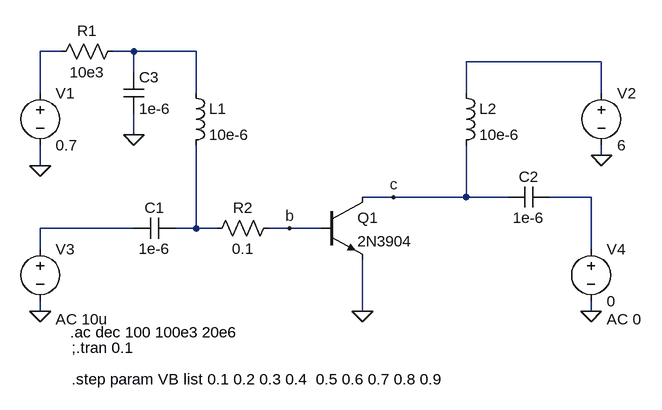
[diagram p0: schematic Draft4.asc]
Draft4.asc, the LTspice schematic file:
Version 4
SHEET 1 880 680
WIRE -256 -160 -288 -160
WIRE -144 -160 -176 -160
WIRE -48 -160 -144 -160
WIRE 576 -144 368 -144
WIRE -144 -128 -144 -160
WIRE -288 -96 -288 -160
WIRE -48 -96 -48 -160
WIRE 368 -96 368 -144
WIRE 576 -96 576 -144
WIRE -144 -32 -144 -64
WIRE 576 0 576 -16
WIRE -288 16 -288 -16
WIRE 256 64 208 64
WIRE 368 64 368 -16
WIRE 368 64 256 64
WIRE 432 64 368 64
WIRE 560 64 496 64
WIRE -144 112 -288 112
WIRE -48 112 -48 -16
WIRE -48 112 -80 112
WIRE -16 112 -48 112
WIRE 96 112 64 112
WIRE 144 112 96 112
WIRE -288 144 -288 112
WIRE 560 144 560 64
WIRE -288 240 -288 224
WIRE 208 240 208 160
WIRE 560 240 560 224
FLAG 208 240 0
FLAG -288 16 0
FLAG 576 0 0
FLAG 560 240 0
FLAG -288 240 0
FLAG -144 -32 0
FLAG 96 112 b
FLAG 256 64 c
SYMBOL npn 144 64 R0
SYMATTR InstName Q1
SYMATTR Value 2N3904
SYMBOL ind -64 -112 R0
SYMATTR InstName L1
SYMATTR Value 10e-6
SYMBOL ind 352 -112 R0
SYMATTR InstName L2
SYMATTR Value 10e-6
SYMBOL cap -80 96 R90
WINDOW 0 0 32 VBottom 2
WINDOW 3 32 32 VTop 2
SYMATTR InstName C1
SYMATTR Value 1e-6
SYMBOL cap 496 48 R90
WINDOW 0 0 32 VBottom 2
WINDOW 3 32 32 VTop 2
SYMATTR InstName C2
SYMATTR Value 1e-6
SYMBOL voltage -288 -112 R0
WINDOW 123 0 0 Left 0
WINDOW 39 0 0 Left 0
SYMATTR InstName V1
SYMATTR Value 0.7
SYMBOL voltage 576 -112 R0
WINDOW 123 0 0 Left 0
WINDOW 39 0 0 Left 0
SYMATTR InstName V2
SYMATTR Value 6
SYMBOL voltage -288 128 R0
WINDOW 123 24 124 Left 2
WINDOW 39 0 0 Left 0
SYMATTR InstName V3
SYMATTR Value ""
SYMATTR Value2 AC 10u
SYMBOL voltage 560 128 R0
WINDOW 123 24 124 Left 2
WINDOW 39 0 0 Left 0
SYMATTR InstName V4
SYMATTR Value 0
SYMATTR Value2 AC 0
SYMBOL res -160 -176 R90
WINDOW 0 0 56 VBottom 2
WINDOW 3 32 56 VTop 2
SYMATTR InstName R1
SYMATTR Value 10e3
SYMBOL cap -160 -128 R0
SYMATTR InstName C3
SYMATTR Value 1e-6
SYMBOL res -32 128 R270
WINDOW 0 32 56 VTop 2
WINDOW 3 0 56 VBottom 2
SYMATTR InstName R2
SYMATTR Value 0.1
TEXT -242 272 Left 2 !.ac dec 100 100e3 20e6
TEXT -240 296 Left 2 !;.tran 0.1
TEXT -240 344 Left 2 !.step param VB list 0.1 0.2 0.3 0.4  0.5 0.6 0.7 0.8 0.9

The netlist it stands for:
* Draft4.asc
Q1 c b 0 0 2N3904
L1 N002 N006 10e-6
L2 N003 c 10e-6
C1 N006 N005 1e-6
C2 N004 c 1e-6
V1 N001 0 0.7
V2 N003 0 6
V3 N005 0 AC 10u
V4 N004 0 0 AC 0
R1 N002 N001 10e3
C3 N002 0 1e-6
R2 N006 b 0.1
.model NPN NPN
.model PNP PNP
.lib standard.bjt
.ac dec 100 100e3 20e6
;.tran 0.1
.step param VB list 0.1 0.2 0.3 0.4  0.5 0.6 0.7 0.8 0.9
.backanno
.end